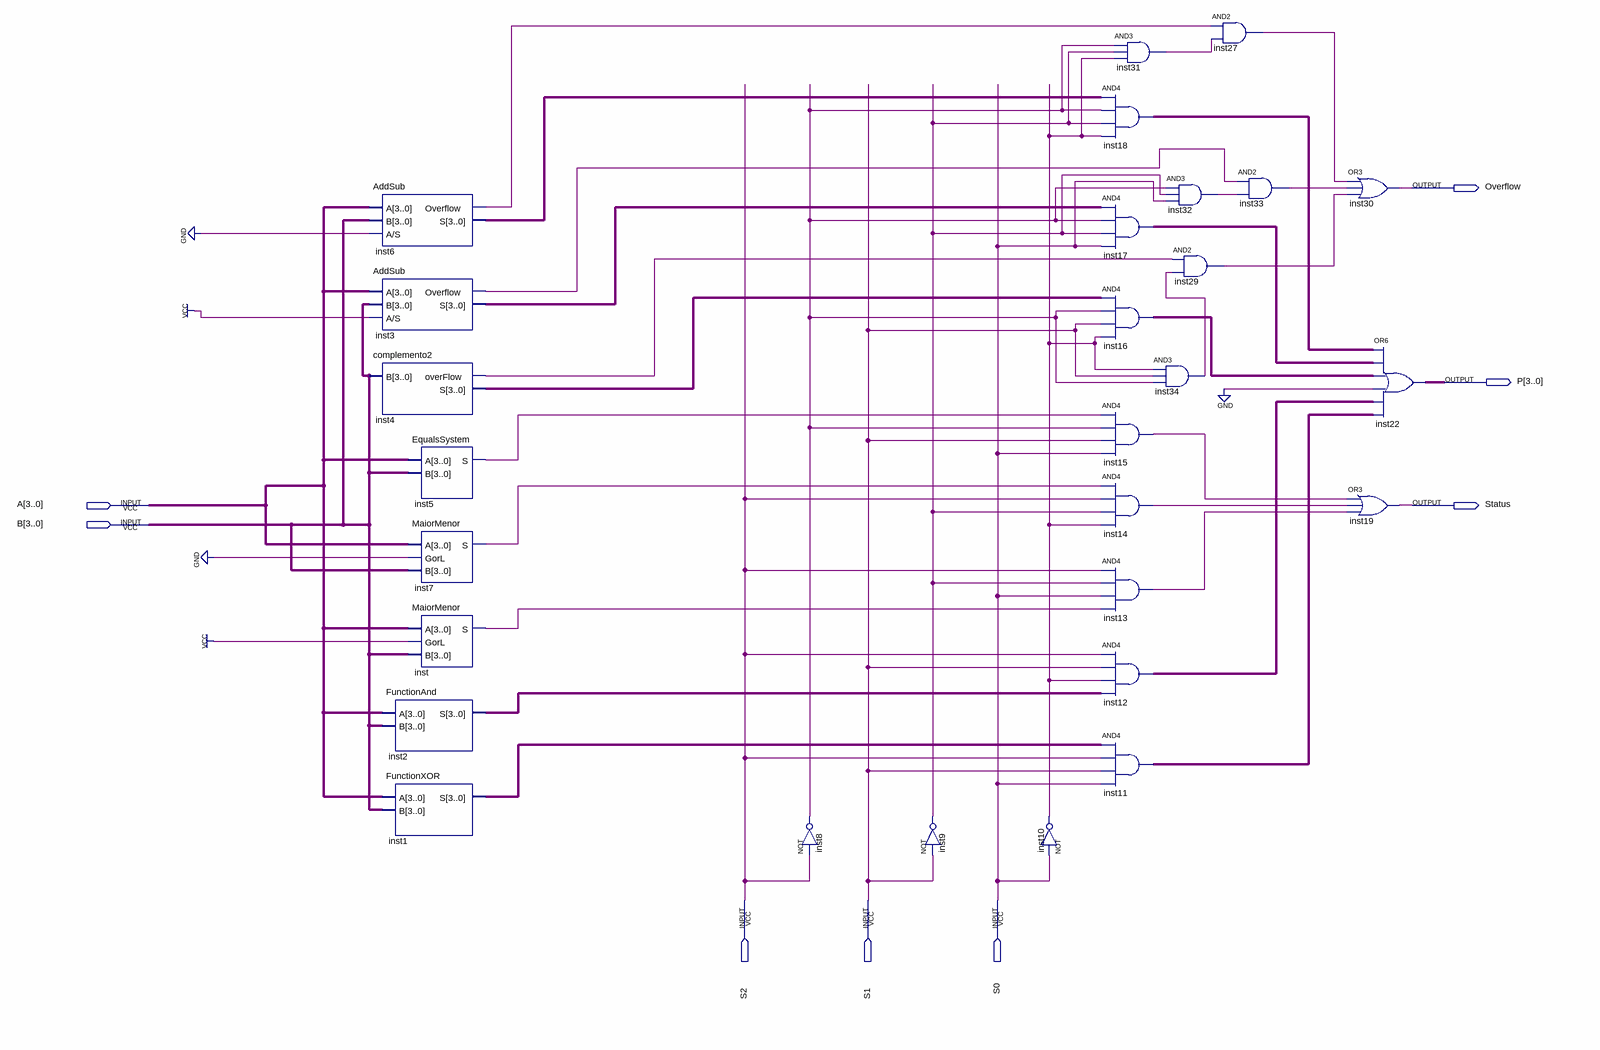
[diagram p0: schematic sheet]
// Quartus schematic Mux.bdf as structural Verilog: 28 symbols, 8 pins
module Mux (
  input  [3:0] A,
  input  [3:0] B,
  input  S2,
  input  S1,
  input  S0,
  output Overflow,
  output [3:0] P,
  output Status
);

  wire inst3_overflow, inst4_overflow, inst5_s, inst6_overflow, inst7_s, inst8_out, inst9_out, inst10_out,
       inst13_out, inst14_out, inst15_out, inst27_out, inst29_out, inst31_out, inst32_out, inst33_out,
       inst34_out, inst_s;
  wire [3:0] inst1_s, inst2_s, inst3_s, inst4_s, inst6_s, inst11_out, inst12_out, inst16_out, inst17_out,
       inst18_out;

  AddSub inst6 (.A(A), .B(B), .\A/S (1'b0), .Overflow(inst6_overflow), .S(inst6_s));
  AddSub inst3 (.A(A), .B(B), .\A/S (1'b1), .Overflow(inst3_overflow), .S(inst3_s));
  complemento2 inst4 (.B(B), .overFlow(inst4_overflow), .S(inst4_s));
  EqualsSystem inst5 (.A(A), .B(B), .S(inst5_s));
  MaiorMenor inst7 (.A(A), .GorL(1'b0), .B(B), .S(inst7_s));
  MaiorMenor inst (.A(A), .GorL(1'b1), .B(B), .S(inst_s));
  FunctionAnd inst2 (.A(A), .B(B), .S(inst2_s));
  FunctionXOR inst1 (.A(A), .B(B), .S(inst1_s));
  not inst8 (inst8_out, S2);
  not inst9 (inst9_out, S1);
  not inst10 (inst10_out, S0);
  assign inst18_out = inst6_s & {4{inst8_out}} & {4{inst9_out}} & {4{inst10_out}};  // AND4 inst18, 4 bits wide
  assign inst17_out = inst3_s & {4{inst8_out}} & {4{inst9_out}} & {4{S0}};  // AND4 inst17, 4 bits wide
  assign inst16_out = inst4_s & {4{inst8_out}} & {4{S1}} & {4{inst10_out}};  // AND4 inst16, 4 bits wide
  and inst15 (inst15_out, inst5_s, inst8_out, S1, S0);
  and inst14 (inst14_out, inst7_s, S2, inst9_out, inst10_out);
  and inst13 (inst13_out, S2, inst9_out, S0, inst_s);
  assign inst12_out = {4{S2}} & {4{S1}} & {4{inst10_out}} & inst2_s;  // AND4 inst12, 4 bits wide
  assign inst11_out = inst1_s & {4{S2}} & {4{S1}} & {4{S0}};  // AND4 inst11, 4 bits wide
  and inst31 (inst31_out, inst8_out, inst9_out, inst10_out);
  and inst34 (inst34_out, inst10_out, S1, inst8_out);
  and inst32 (inst32_out, inst8_out, inst9_out, S0);
  and inst29 (inst29_out, inst4_overflow, inst34_out);
  and inst27 (inst27_out, inst6_overflow, inst31_out);
  and inst33 (inst33_out, inst3_overflow, inst32_out);
  or inst30 (Overflow, inst27_out, inst33_out, inst29_out);
  or inst19 (Status, inst15_out, inst14_out, inst13_out);
  assign P = inst18_out | inst17_out | inst16_out | 4'b0000 | inst12_out | inst11_out;  // OR6 inst22, 4 bits wide
endmodule
